# EAGLE design M115C (EAGLE 6.6.0)
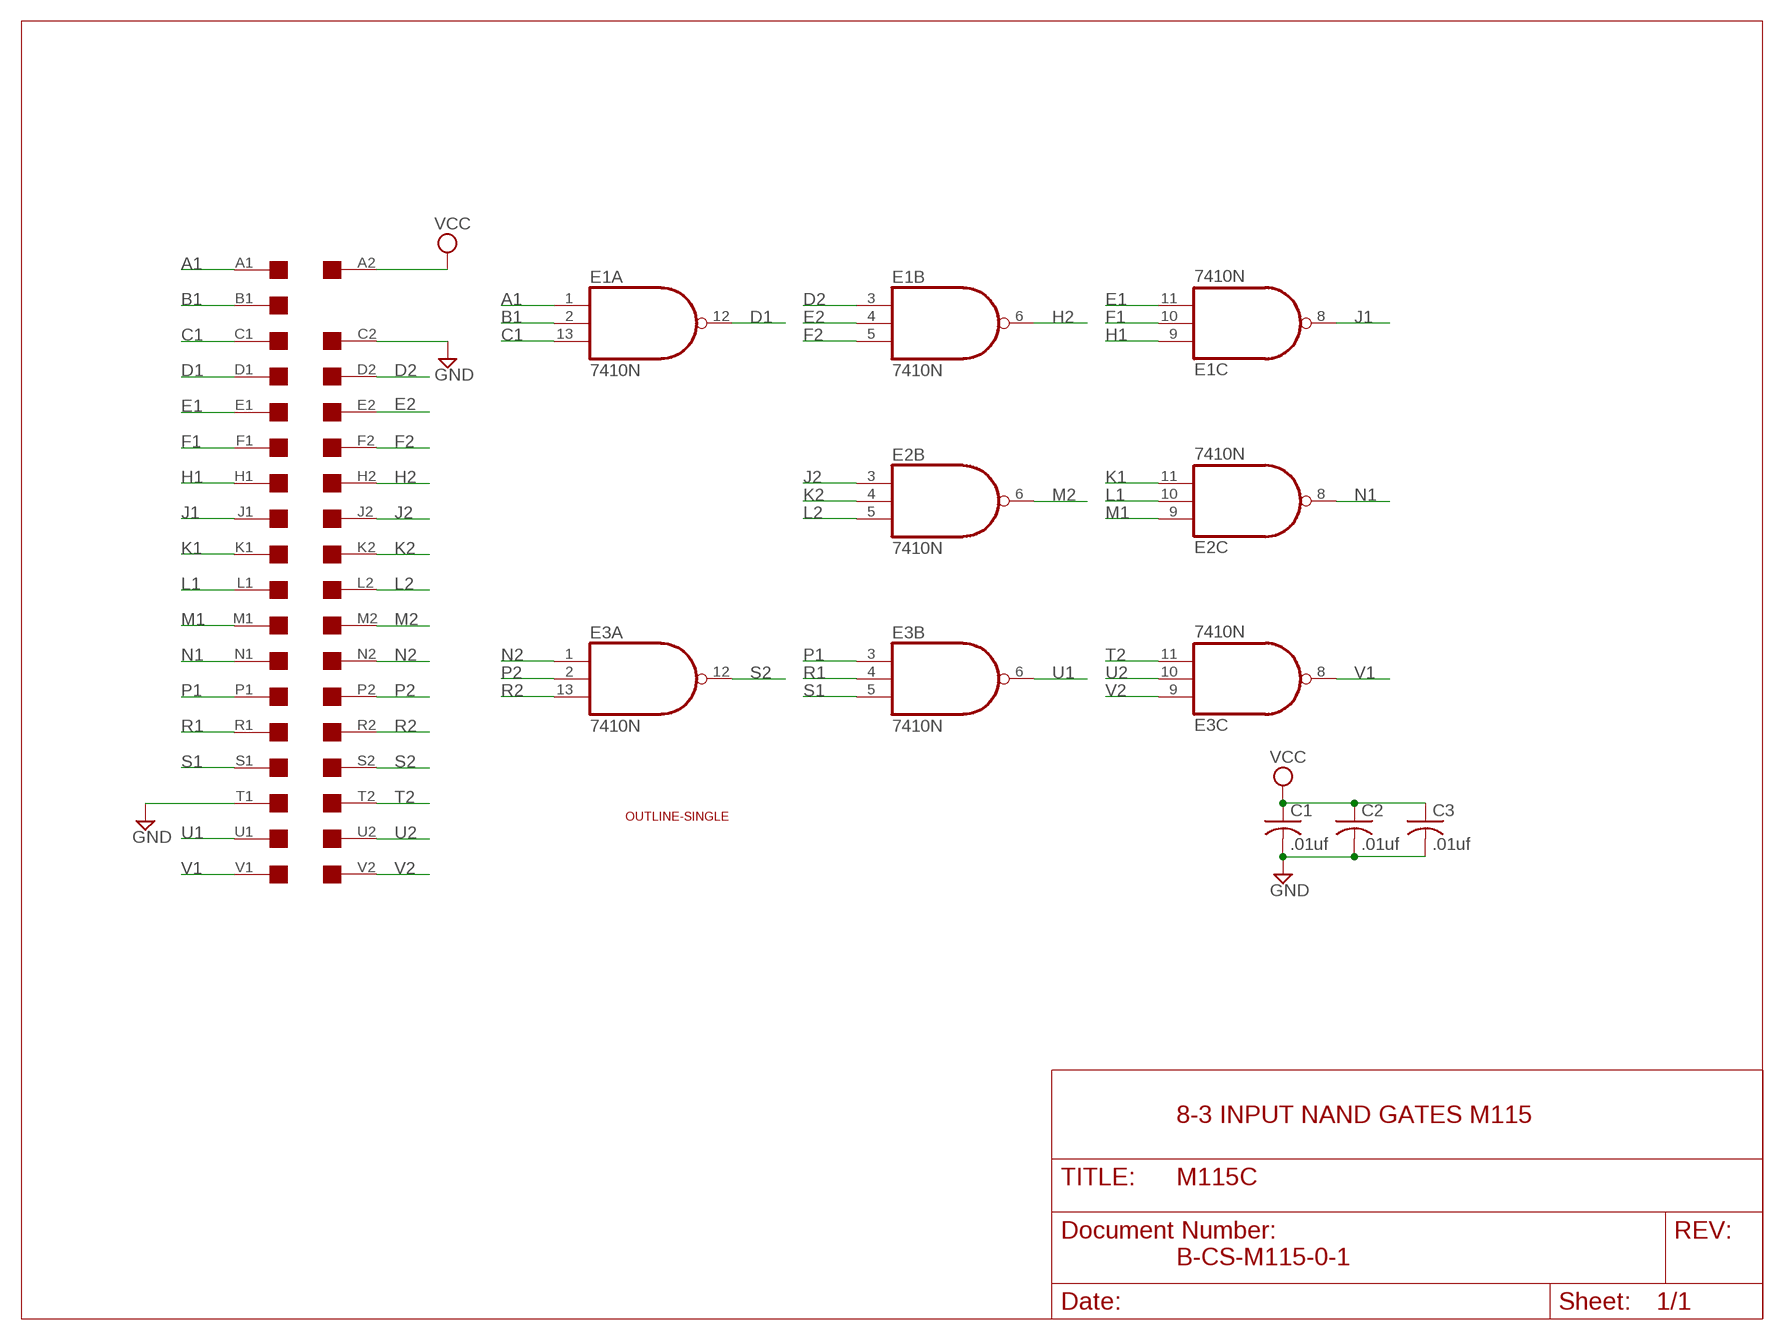
[diagram p0: schematic, sheet 1]

## Parts
C1  .01uf  C-US050-025X075  [C050-025X075]
C2  .01uf  C-US050-025X075  [C050-025X075]
C3  .01uf  C-US050-025X075  [C050-025X075]
E1  7410N  [DIL14]
E2  7410N  [DIL14]
E3  7410N  [DIL14]
U$1  SINGLE  [EDGE-CON2]
U$4  OUTLINE-SINGLE  [SINGLE]

## Nets
A1: E1.1(A:I0) U$1.A1
B1: E1.2(A:I1) U$1.B1
C1: E1.13(A:I2) U$1.C1
D1: E1.12(A:O) U$1.D1
D2: E1.3(B:I0) U$1.D2
E1: E1.11(C:I2) U$1.E1
E2: E1.4(B:I1) U$1.E2
F1: E1.10(C:I1) U$1.F1
F2: E1.5(B:I2) U$1.F2
GND [Supply]: C1.2 C2.2 C3.2 U$1.C2 U$1.T1
H1: E1.9(C:I0) U$1.H1
H2: E1.6(B:O) U$1.H2
J1: E1.8(C:O) U$1.J1
J2: E2.3(B:I0) U$1.J2
K1: E2.11(C:I2) U$1.K1
K2: E2.4(B:I1) U$1.K2
L1: E2.10(C:I1) U$1.L1
L2: E2.5(B:I2) U$1.L2
M1: E2.9(C:I0) U$1.M1
M2: E2.6(B:O) U$1.M2
N1: E2.8(C:O) U$1.N1
N2: E3.1(A:I0) U$1.N2
P1: E3.3(B:I0) U$1.P1
P2: E3.2(A:I1) U$1.P2
R1: E3.4(B:I1) U$1.R1
R2: E3.13(A:I2) U$1.R2
S1: E3.5(B:I2) U$1.S1
S2: E3.12(A:O) U$1.S2
T2: E3.11(C:I2) U$1.T2
U1: E3.6(B:O) U$1.U1
U2: E3.10(C:I1) U$1.U2
V1: E3.8(C:O) U$1.V1
V2: E3.9(C:I0) U$1.V2
VCC [Supply]: C1.1 C2.1 C3.1 U$1.A2
Unconnected: E2.1(A:I0) E2.2(A:I1) E2.12(A:O) E2.13(A:I2) U$1.B2

## Notes on the sheet
- 8-3 INPUT NAND GATES M115
- B-CS-M115-0-1

## Power pins joined to a net without a drawn wire
GND: E1.7(P:GND) E2.7(P:GND) E3.7(P:GND)
VCC: E1.14(P:VCC) E2.14(P:VCC) E3.14(P:VCC)

## Library data of the parts
C1-C3 = rcl:C-US: CAPACITOR, American symbol
E1-E3 = 74xx-us:74*10: Triple 3-input NAND gate
U$1 = dec-con:SINGLE: Single-Height DEC board
U$4 = dec-con:OUTLINE-*: Board outlines for DEC boards.

## Net classes
1 Supply: width 0.813 mm

## Board
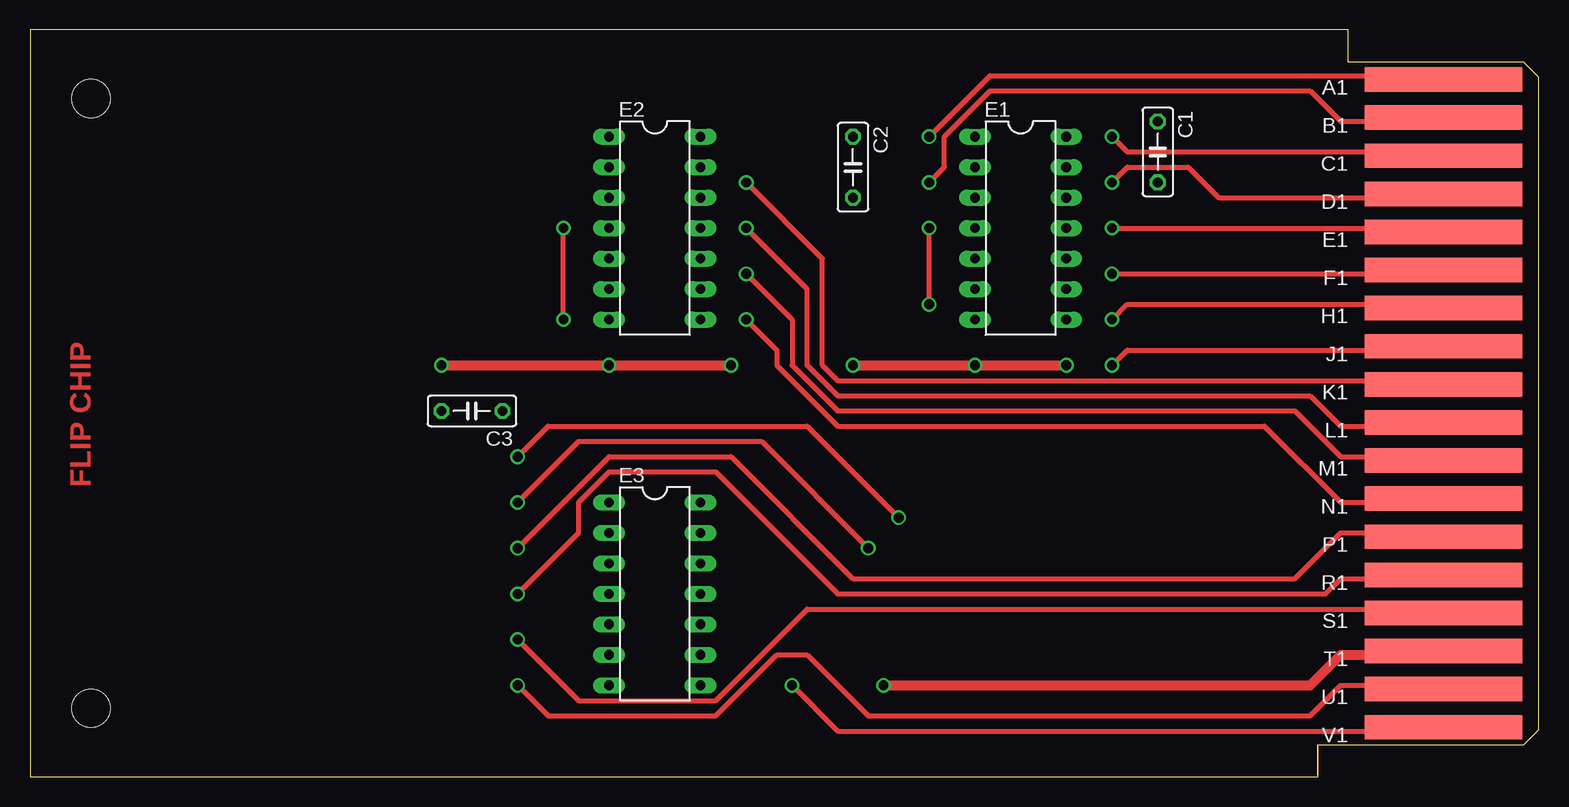
[diagram p1: board, top side]
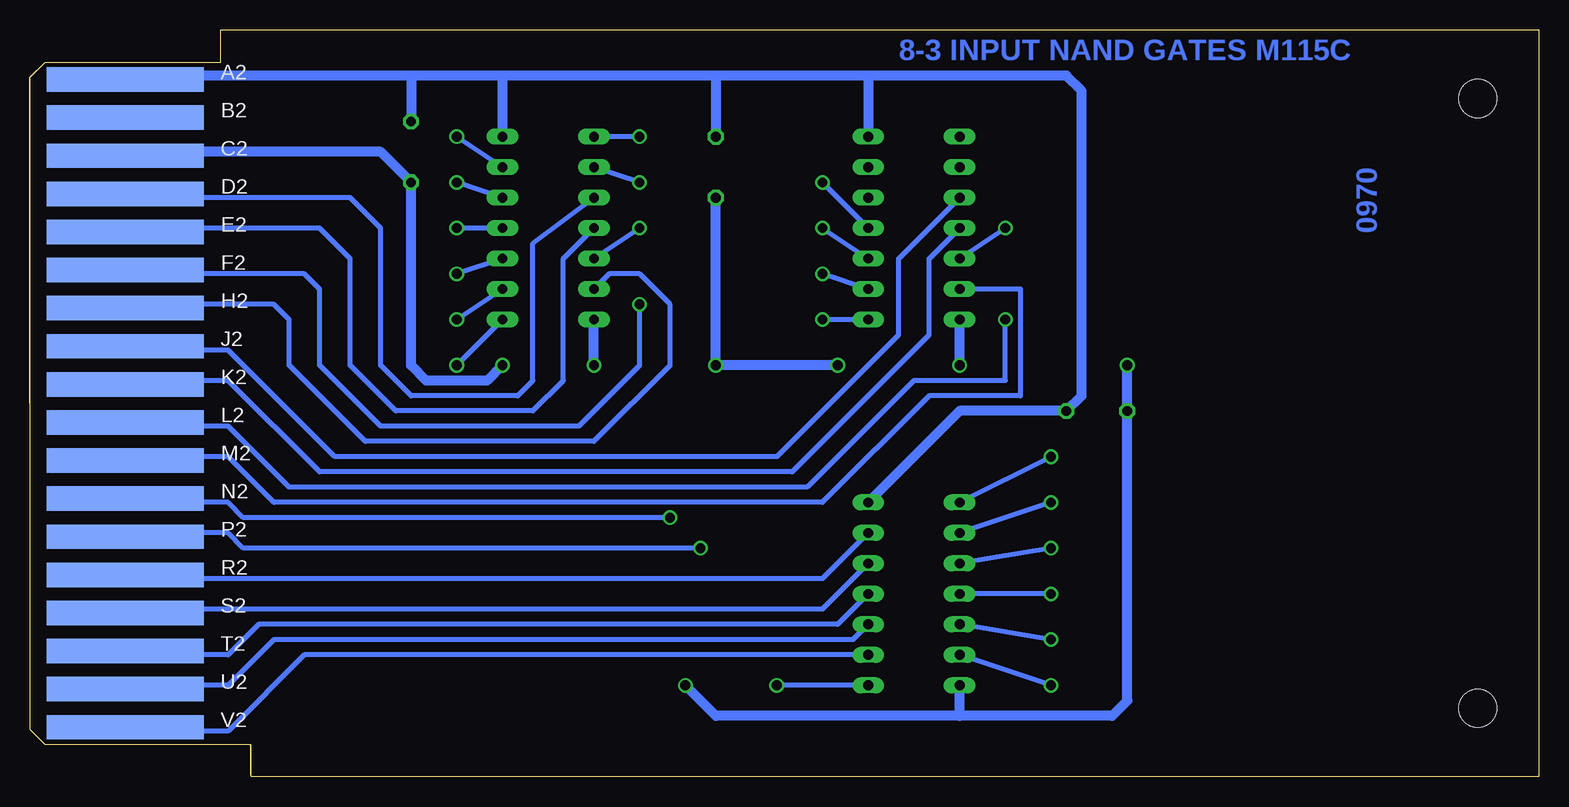
[diagram p2: board, bottom side, seen from below]

Size 125.73 x 62.23 mm. Coordinates in mm from the lower left corner, seen from the top.
Copper layers (1+16): Top 0.035mm / dielectric 1.5mm / Bottom 0.035mm
Design rules "16mils": minimum track width 16mil, minimum drill 32mil, track to track 15mil, track to pad 10mil, pad to pad 10mil, via to via 10mil, smd to smd 10mil, copper to edge 13mil, drill to drill 10mil, minimum pad ring 10mil, minimum via ring 8mil, stop-mask expansion 0mil, vias tented up to drill 0mil, thermal gap 10mil

### Footprints (pad centres in the part's own frame; a part is rotated, then mirrored left to right if it is on the bottom)
C050-025X075 = drill 0.813 octagon: 1 -2.54,0; 2 2.54,0
DIL14 = drill 0.813 long: 1 -7.62,-3.81; 2 -5.08,-3.81; 3 -2.54,-3.81; 4 0,-3.81; 5 2.54,-3.81; 6 5.08,-3.81; 7 7.62,-3.81; 8 7.62,3.81; 9 5.08,3.81; 10 2.54,3.81; 11 0,3.81; 12 -2.54,3.81; 13 -5.08,3.81; 14 -7.62,3.81
EDGE-CON2 = smd 13.106 x 2.032: A1 7.938,4.128; B1 7.938,7.303; C1 7.938,10.477; D1 7.938,13.652; E1 7.938,16.828; F1 7.938,20.003; H1 7.938,23.177; J1 7.938,26.352; K1 7.938,29.527; L1 7.938,32.703; M1 7.938,35.877; N1 7.938,39.053; P1 7.938,42.227; R1 7.938,45.403; S1 7.938,48.578; T1 7.938,51.752; U1 7.938,54.928; V1 7.938,58.102 | smd 13.106 x 2.032 bottom: A2 7.938,4.128; B2 7.938,7.303; C2 7.938,10.477; D2 7.938,13.652; E2 7.938,16.828; F2 7.938,20.003; H2 7.938,23.177; J2 7.938,26.352; K2 7.938,29.527; L2 7.938,32.703; M2 7.938,35.877; N2 7.938,39.053; P2 7.938,42.227; R2 7.938,45.403; S2 7.938,48.578; T2 7.938,51.752; U2 7.938,54.928; V2 7.938,58.102
SINGLE = hole 3.175: 120.65,56.515; 120.65,5.715

### Placement (x,y rotation side)
C1  93.98,52.07 270 top
C2  68.58,50.8 270 top
C3  36.83,30.48 180 top
E1  82.55,45.72 270 top
E2  52.07,45.72 270 top
E3  52.07,15.24 270 top
U$1  125.73,62.23 180 top
U$4  125.73,62.23 180 top

### Tracks (layer width: path | path; a pad name or v marks a point on that pad's centre or on a via)
A1  (via drill 0.81)
  Top 0.406: U$1.A1 111.76,58.42 80.01,58.42 v74.93,53.34
  Bottom 0.406: v74.93,53.34 E1.1
B1  (via drill 0.81)
  Top 0.406: U$1.B1 111.76,54.61 109.22,54.61 106.68,57.15 80.01,57.15 76.2,53.34 76.2,50.8 v74.93,49.53
  Bottom 0.406: v74.93,49.53 E1.2
C1  (via drill 0.81)
  Top 0.406: U$1.C1 112.09,51.74 111.76,52.07 91.44,52.07 v90.17,53.34
  Bottom 0.406: E1.13 v90.17,53.34
D1  (via drill 0.81)
  Top 0.406: U$1.D1 112.06,48.56 111.76,48.26 99.06,48.26 96.52,50.8 91.44,50.8 v90.17,49.53
  Bottom 0.406: E1.12 v90.17,49.53
D2
  Bottom 0.406: E1.3 83.82,44.45 83.82,33.02 85.09,31.75 93.98,31.75 96.52,34.29 96.52,45.72 99.06,48.26 111.76,48.26 U$1.D2
E1  (via drill 0.81)
  Top 0.406: U$1.E1 112.09,45.39 111.76,45.72 v90.17,45.72
  Bottom 0.406: E1.11 v90.17,45.72
E2
  Bottom 0.406: E1.4 81.28,43.18 81.28,33.02 83.82,30.48 95.25,30.48 99.06,34.29 99.06,43.18 101.6,45.72 111.76,45.72 U$1.E2
F1  (via drill 0.81)
  Top 0.406: U$1.F1 112.04,42.19 111.76,41.91 v90.17,41.91
  Bottom 0.406: E1.10 v90.17,41.91
F2  (via drill 0.81)
  Top 0.406: v74.93,39.37 v74.93,45.72
  Bottom 0.406: v74.93,45.72 E1.5 | v74.93,39.37 74.93,34.29 80.01,29.21 96.52,29.21 101.6,34.29 101.6,40.64 102.87,41.91 111.76,41.91 U$1.F2
GND  (via drill 0.81)
  Top 0.813: v86.36,34.29 v78.74,34.29 v68.58,34.29 | v58.42,34.29 v48.26,34.29 v34.29,34.29 | U$1.T1 112.09,10.49 111.76,10.16 109.22,10.16 106.68,7.62 v71.12,7.62
  Bottom 0.813: U$1.C2 112.09,51.74 111.76,52.07 96.52,52.07 C1.2 93.98,34.29 92.71,33.02 87.63,33.02 v86.36,34.29 | v78.74,34.29 E1.7 | C2.2 v68.58,34.29 v58.42,34.29 | v48.26,34.29 E2.7 | v34.29,34.29 C3.2 34.29,6.35 35.56,5.08 48.26,5.08 | 48.26,5.08 68.58,5.08 v71.12,7.62 | 48.26,5.08 E3.7
H1  (via drill 0.81)
  Top 0.406: U$1.H1 112.7,39.04 111.76,39.37 91.44,39.37 v90.17,38.1
  Bottom 0.406: E1.9 v90.17,38.1
H2
  Bottom 0.406: E1.6 77.47,41.91 74.93,41.91 72.39,39.37 72.39,34.29 78.74,27.94 97.79,27.94 104.14,34.29 104.14,38.1 105.41,39.37 111.76,39.37 U$1.H2
J1  (via drill 0.81)
  Top 0.406: U$1.J1 112.09,35.89 111.76,35.56 91.44,35.56 v90.17,34.29
  Bottom 0.406: v90.17,34.29 E1.8
J2
  Bottom 0.406: E2.3 53.34,43.18 53.34,36.83 63.5,26.67 100.33,26.67 109.22,35.56 111.76,35.56 U$1.J2
K1  (via drill 0.81)
  Top 0.406: U$1.K1 112.06,32.72 111.76,33.02 67.31,33.02 66.04,34.29 66.04,43.18 v59.69,49.53
  Bottom 0.406: v59.69,49.53 E2.11
K2
  Bottom 0.406: E2.4 50.8,43.18 50.8,36.83 62.23,25.4 101.6,25.4 109.22,33.02 111.76,33.02 U$1.K2
L1  (via drill 0.81)
  Top 0.406: U$1.L1 112.09,29.54 111.76,29.21 109.22,29.21 106.68,31.75 67.31,31.75 64.77,34.29 64.77,40.64 v59.69,45.72
  Bottom 0.406: v59.69,45.72 E2.10
L2  (via drill 0.81)
  Top 0.406: v44.45,38.1 v44.45,45.72
  Bottom 0.406: v44.45,45.72 E2.5 | v44.45,38.1 44.45,33.02 52.07,33.02 60.96,24.13 104.14,24.13 109.22,29.21 111.76,29.21 U$1.L2
M1  (via drill 0.81)
  Top 0.406: U$1.M1 111.76,26.67 109.22,26.67 105.41,30.48 67.31,30.48 63.5,34.29 63.5,38.1 v59.69,41.91
  Bottom 0.406: E2.9 v59.69,41.91
M2
  Bottom 0.406: E2.6 43.18,40.64 43.18,31.75 50.8,31.75 59.69,22.86 105.41,22.86 109.22,26.67 111.76,26.67 U$1.M2
N1  (via drill 0.81)
  Top 0.406: U$1.N1 111.76,22.86 109.22,22.86 102.87,29.21 67.31,29.21 62.23,34.29 62.23,35.56 v59.69,38.1
  Bottom 0.406: E2.8 v59.69,38.1
N2  (via drill 0.81)
  Top 0.406: v72.39,21.59 64.77,29.21 43.18,29.21 v40.64,26.67
  Bottom 0.406: v40.64,26.67 E3.1 | U$1.N2 111.76,22.86 109.22,22.86 107.95,21.59 v72.39,21.59
P1  (via drill 0.81)
  Top 0.406: U$1.P1 111.76,20.32 109.22,20.32 105.41,16.51 68.58,16.51 58.42,26.67 48.26,26.67 v40.64,19.05
  Bottom 0.406: v40.64,19.05 E3.3
P2  (via drill 0.81)
  Top 0.406: v40.64,22.86 45.72,27.94 60.96,27.94 v69.85,19.05
  Bottom 0.406: U$1.P2 117.76,20.32 109.22,20.32 107.95,19.05 v69.85,19.05 | v40.64,22.86 E3.2
R1  (via drill 0.81)
  Top 0.406: U$1.R1 112.09,16.84 111.76,16.51 109.22,16.51 107.95,15.24 67.31,15.24 57.15,25.4 48.26,25.4 45.72,22.86 45.72,20.32 v40.64,15.24
  Bottom 0.406: v40.64,15.24 E3.4
R2
  Bottom 0.406: U$1.R2 117.76,16.51 59.69,16.51 E3.13
S1  (via drill 0.81)
  Top 0.406: v40.64,11.43 45.72,6.35 57.15,6.35 64.77,13.97 111.76,13.97 U$1.S1
  Bottom 0.406: v40.64,11.43 E3.5
S2
  Bottom 0.406: U$1.S2 117.78,13.97 59.69,13.97 E3.12
T2
  Bottom 0.406: U$1.T2 117.76,10.16 109.22,10.16 106.68,12.7 58.42,12.7 E3.11
U1  (via drill 0.81)
  Top 0.406: v40.64,7.62 43.18,5.08 57.15,5.08 62.23,10.16 64.77,10.16 69.85,5.08 106.68,5.08 109.22,7.62 111.76,7.62 U$1.U1
  Bottom 0.406: v40.64,7.62 E3.6
U2
  Bottom 0.406: U$1.U2 117.73,7.62 109.22,7.62 105.41,11.43 57.15,11.43 E3.10
V1  (via drill 0.81)
  Top 0.406: U$1.V1 111.76,3.81 67.31,3.81 v63.5,7.62
  Bottom 0.406: E3.8 v63.5,7.62
V2
  Bottom 0.406: U$1.V2 111.76,3.81 109.22,3.81 102.87,10.16 E3.9
VCC
  Bottom 0.813: U$1.A2 111.76,58.02 111.76,58.42 93.98,58.42 | 55.88,58.42 39.37,58.42 38.1,57.15 38.1,31.75 C3.1 48.26,30.48 E3.14 | 55.88,58.42 68.58,58.42 | 68.58,58.42 86.36,58.42 | 86.36,58.42 93.98,58.42 | 93.98,58.42 C1.1 | 68.58,58.42 C2.1 | 55.88,58.42 E2.14 | 86.36,58.42 E1.14

### Text on the board
Top: FLIP CHIP
Bottom: 8-3 INPUT NAND GATES M115C | 0970